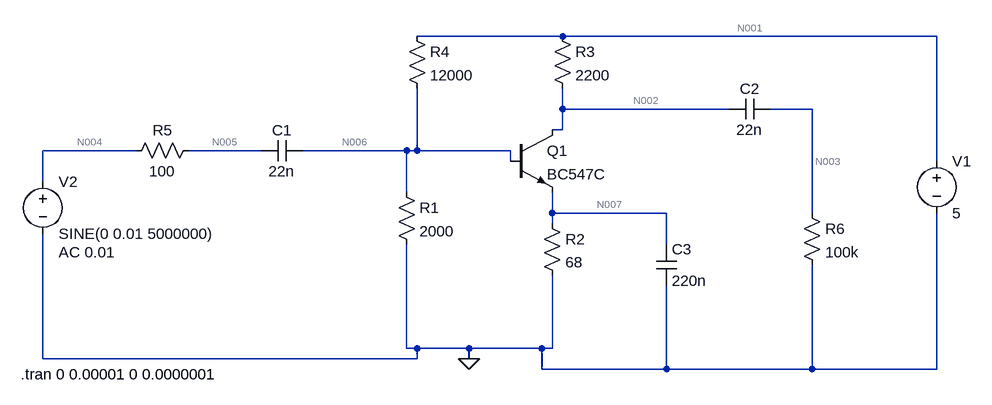
[diagram p0: schematic Preamp.asc]
Preamp.asc, the LTspice schematic file:
Version 4
SHEET 1 920 680
WIRE 288 -48 64 -48
WIRE 864 -48 288 -48
WIRE 288 64 288 32
WIRE 544 64 288 64
WIRE 672 64 608 64
WIRE 288 96 288 64
WIRE 288 96 272 96
WIRE -368 128 -512 128
WIRE -176 128 -288 128
WIRE 48 128 -112 128
WIRE 64 128 64 32
WIRE 64 128 48 128
WIRE 208 128 64 128
WIRE 208 144 208 128
WIRE 864 144 864 -48
WIRE -512 176 -512 128
WIRE 48 192 48 128
WIRE 272 224 272 192
WIRE 448 224 272 224
WIRE 672 224 672 64
WIRE 272 240 272 224
WIRE 448 272 448 224
WIRE 48 432 48 272
WIRE 64 432 48 432
WIRE 144 432 64 432
WIRE 256 432 144 432
WIRE 272 432 272 320
WIRE 272 432 256 432
WIRE -512 448 -512 256
WIRE 64 448 64 432
WIRE 64 448 -512 448
WIRE 144 448 144 432
WIRE 256 464 256 432
WIRE 448 464 448 336
WIRE 448 464 256 464
WIRE 672 464 672 304
WIRE 672 464 448 464
WIRE 864 464 864 224
WIRE 864 464 672 464
FLAG 144 448 0
SYMBOL npn 208 96 R0
SYMATTR InstName Q1
SYMATTR Value BC547C
SYMBOL res 32 176 R0
SYMATTR InstName R1
SYMATTR Value 2000
SYMBOL res 256 224 R0
SYMATTR InstName R2
SYMATTR Value 68
SYMBOL res 272 -64 R0
SYMATTR InstName R3
SYMATTR Value 2200
SYMBOL res 48 -64 R0
SYMATTR InstName R4
SYMATTR Value 12000
SYMBOL cap 608 48 R90
WINDOW 0 0 32 VBottom 2
WINDOW 3 32 32 VTop 2
SYMATTR InstName C2
SYMATTR Value 22n
SYMBOL cap -112 112 R90
WINDOW 0 0 32 VBottom 2
WINDOW 3 32 32 VTop 2
SYMATTR InstName C1
SYMATTR Value 22n
SYMBOL voltage 864 128 R0
WINDOW 123 0 0 Left 0
WINDOW 39 0 0 Left 0
SYMATTR InstName V1
SYMATTR Value 5
SYMBOL voltage -512 160 R0
WINDOW 123 24 124 Left 2
WINDOW 39 0 0 Left 0
SYMATTR InstName V2
SYMATTR Value SINE(0 0.01 5000000)
SYMATTR Value2 AC 0.01
SYMBOL res -272 112 R90
WINDOW 0 0 56 VBottom 2
WINDOW 3 32 56 VTop 2
SYMATTR InstName R5
SYMATTR Value 100
SYMBOL res 656 208 R0
SYMATTR InstName R6
SYMATTR Value 100k
SYMBOL cap 432 272 R0
SYMATTR InstName C3
SYMATTR Value 220n
TEXT -546 472 Left 2 !.tran 0 0.00001 0 0.0000001

The netlist it stands for:
* Preamp.asc
Q1 N002 N006 N007 0 BC547C
R1 N006 0 2000
R2 N007 0 68
R3 N001 N002 2200
R4 N001 N006 12000
C2 N003 N002 22n
C1 N006 N005 22n
V1 N001 0 5
V2 N004 0 SINE(0 0.01 5000000) AC 0.01
R5 N005 N004 100
R6 N003 0 100k
C3 N007 0 220n
.model NPN NPN
.model PNP PNP
.lib standard.bjt
.tran 0 0.00001 0 0.0000001
.backanno
.end

* Results of the author's LTspice run, read from the files saved beside the schematic
* Operating Point, zero values left out:
*   V(n002) = 2.309 V
*   V(n006) = 709.8 mV
*   V(n007) = 83.35 mV
*   V(n001) = 5 V
*   Ic(Q1) = 1.223 mA
*   Ib(Q1) = 2.627 µA
*   Ie(Q1) = -1.226 mA
*   I(R4) = 357.5 µA
*   I(R3) = 1.223 mA
*   I(R2) = 1.226 mA
*   I(R1) = 354.9 µA
*   I(V1) = -1.581 mA
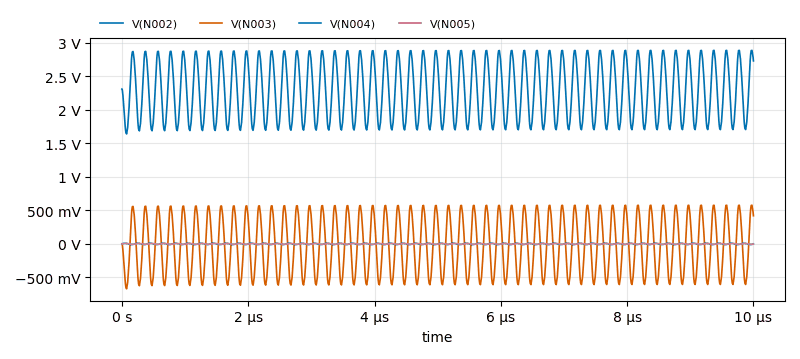
[diagram p1: Transient Analysis of Preamp.asc, plotted from the saved traces]
* Transient Analysis, 1 run:
*   V(N002): min 1.639 V, max 2.886 V, average 2.293 V, rms 2.331 V, last 2.729 V
*   V(N003): min -669.7 mV, max 576.5 mV, average -16.46 mV, rms 422.7 mV, last 419.5 mV
*   V(N004): min -9.995 mV, max 9.995 mV, average 51 nV, rms 7.187 mV, last 0 V
*   V(N005): min -6.958 mV, max 6.669 mV, average 1.312 µV, rms 4.694 mV, last -3.819 mV